# EAGLE design audio-mixer-smd (EAGLE 6.6.0)
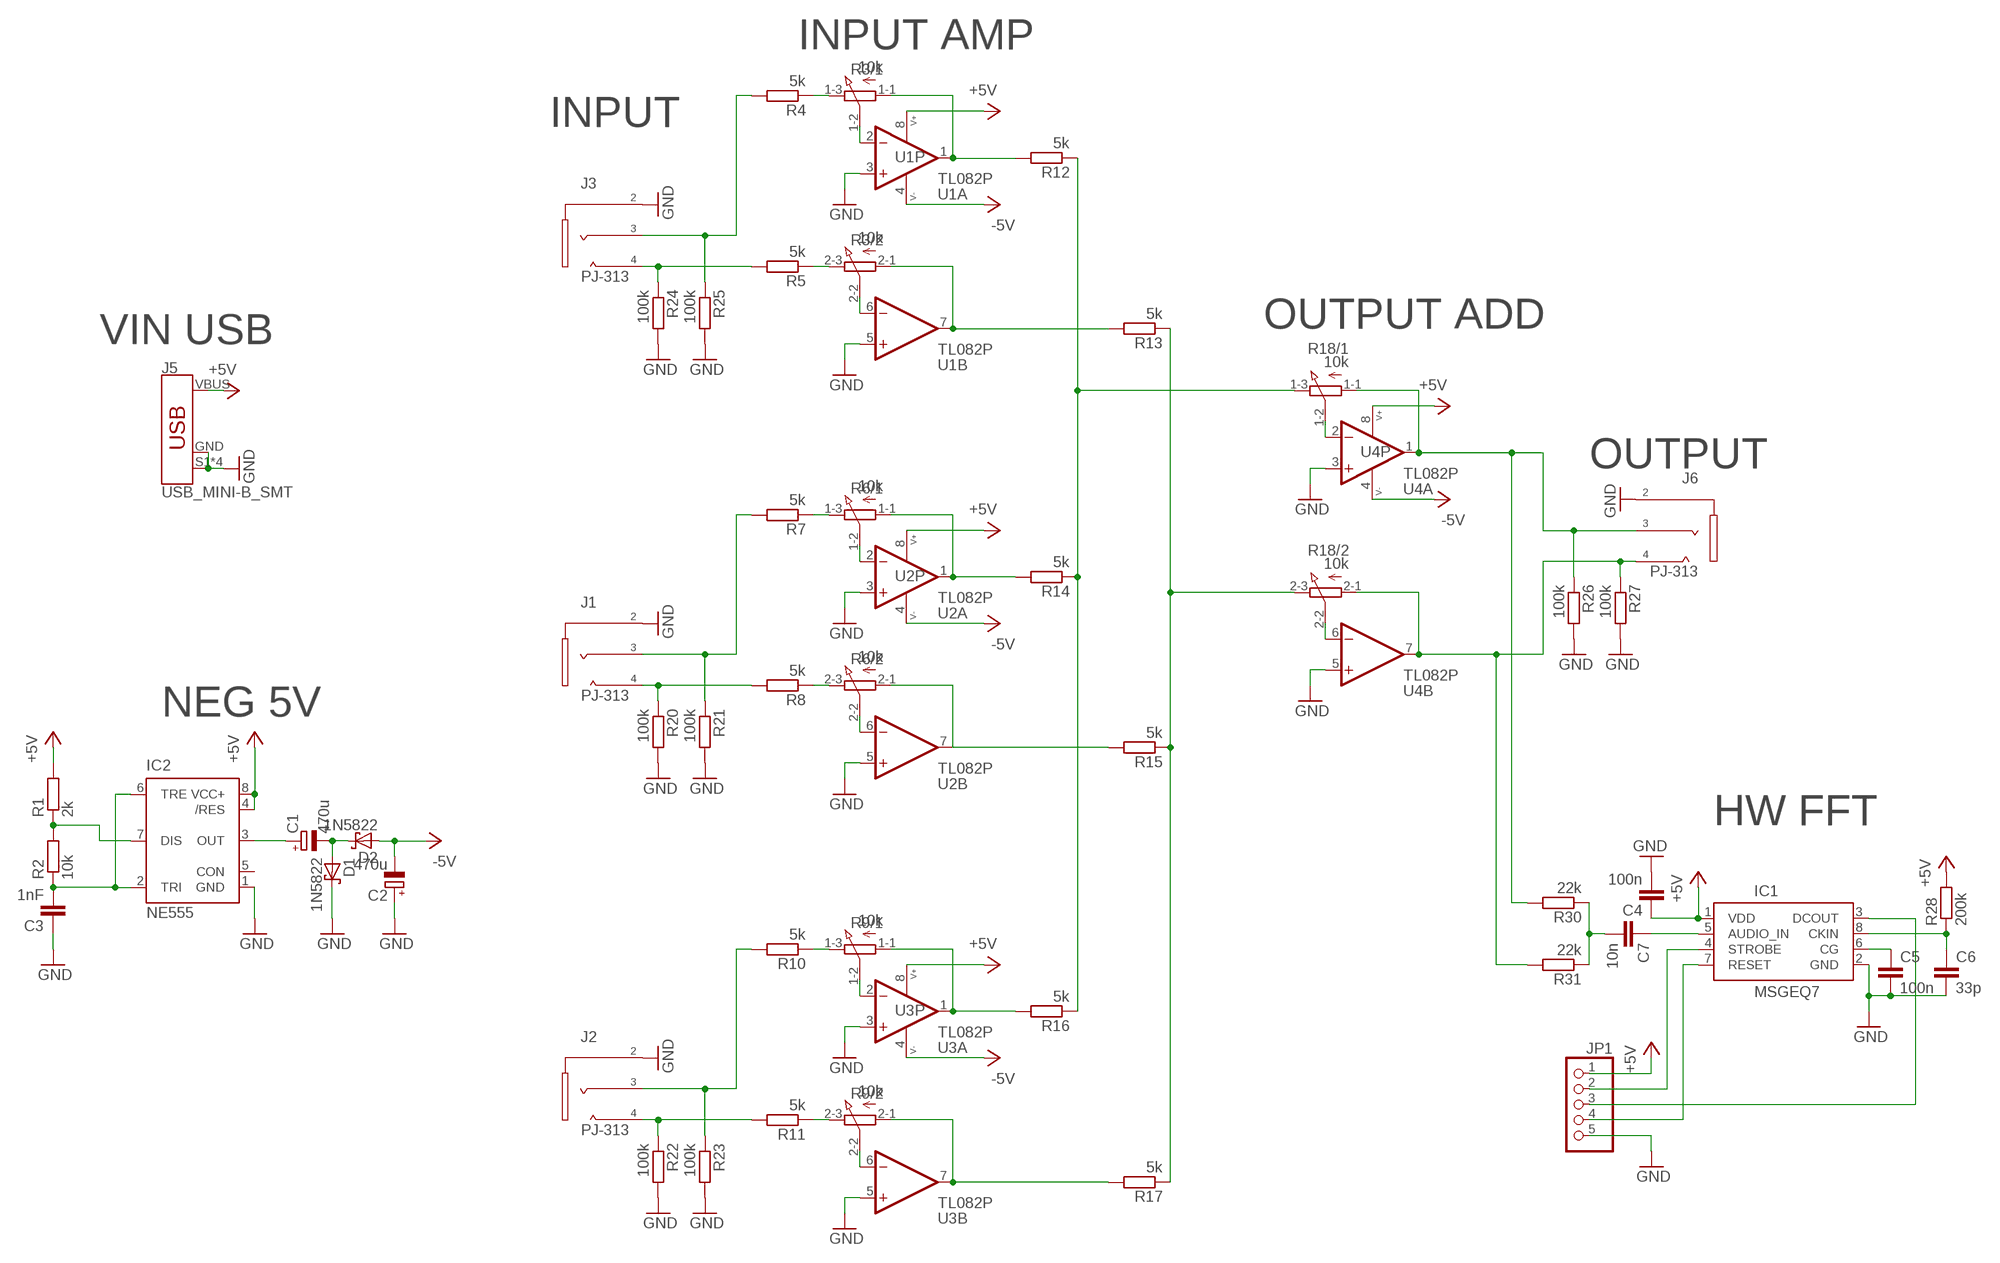
[diagram p0: schematic, sheet 1]

## Parts
C1  470u  CPOL-EUE5-8.5  [E5-8,5]
C2  470u  CPOL-EUE5-8.5  [E5-8,5]
C3  1nF  C-EUC0805  [C0805]
C4  100n  C-EUC0805  [C0805]
C5  100n  C-EUC0805  [C0805]
C6  33p  C-EUC0805  [C0805]
C7  10n  C-EUC0805  [C0805]
D1  1N5822  1N5817-B  [DO41-7.6]
D2  1N5822  1N5817-B  [DO41-7.6]
IC1  MSGEQ7DIP  [DIL08]
IC2  NE555  [DIL-08]
J1  PJ-313  [PJ-313]
J2  PJ-313  [PJ-313]
J3  PJ-313  [PJ-313]
J5  USB_MINI-B_SMT  [USB-MINIB]
J6  PJ-313  [PJ-313]
JP1  PINHD-1X05_2.54-S  [1X05-S]
R1  2k  R-EU_R0805  [R0805]
R2  10k  R-EU_R0805  [R0805]
R3  10k  3RP/1610G  [3RP/1610G]
R4  5k  R-EU_R0805  [R0805]
R5  5k  R-EU_R0805  [R0805]
R6  10k  3RP/1610G  [3RP/1610G]
R7  5k  R-EU_R0805  [R0805]
R8  5k  R-EU_R0805  [R0805]
R9  10k  3RP/1610G  [3RP/1610G]
R10  5k  R-EU_R0805  [R0805]
R11  5k  R-EU_R0805  [R0805]
R12  5k  R-EU_R0805  [R0805]
R13  5k  R-EU_R0805  [R0805]
R14  5k  R-EU_R0805  [R0805]
R15  5k  R-EU_R0805  [R0805]
R16  5k  R-EU_R0805  [R0805]
R17  5k  R-EU_R0805  [R0805]
R18  10k  3RP/1610G  [3RP/1610G]
R20  100k  R-EU_R0805  [R0805]
R21  100k  R-EU_R0805  [R0805]
R22  100k  R-EU_R0805  [R0805]
R23  100k  R-EU_R0805  [R0805]
R24  100k  R-EU_R0805  [R0805]
R25  100k  R-EU_R0805  [R0805]
R26  100k  R-EU_R0805  [R0805]
R27  100k  R-EU_R0805  [R0805]
R28  200k  R-EU_R0805  [R0805]
R30  22k  R-EU_R0805  [R0805]
R31  22k  R-EU_R0805  [R0805]
U1  TL082P  [DIL08]
U2  TL082P  [DIL08]
U3  TL082P  [DIL08]
U4  TL082P  [DIL08]

## Nets
+5V [power]: C4.1 IC1.1(VDD) IC2.4(/RES) IC2.8(VCC+) J5.VBUS JP1.1 R1.2 R28.2 U1.8(P:V+) U2.8(P:V+) U3.8(P:V+) U4.8(P:V+)
-5V [power]: C2.- D2.A U1.4(P:V-) U2.4(P:V-) U3.4(P:V-) U4.4(P:V-)
GND [power]: C2.+ C3.1 C4.2 C5.2 C6.2 D1.C IC1.2(GND) IC2.1(GND) J1.2_1 J1.2_2 J2.2_1 J2.2_2 J3.2_1 J3.2_2 J5.GND J5.S1(SHIELD) J5.S2(SHIELD) J5.S3(SHIELD) J5.S4(SHIELD) J6.2_1 J6.2_2 JP1.5 R20.2 R21.2 R22.2 R23.2 R24.2 R25.2 R26.2 R27.2 U1.3(A:+IN) U1.5(B:+IN) U2.3(A:+IN) U2.5(B:+IN) U3.3(A:+IN) U3.5(B:+IN) U4.3(A:+IN) U4.5(B:+IN)
N$1: C3.2 IC2.2(TRI) IC2.6(TRE) R2.1
N$2: IC2.7(DIS) R1.1 R2.2
N$3: R3.1-1(/1:A) R12.2 U1.1(A:OUT)
N$4 [power]: C1.- D1.A D2.C
N$5 [power]: C1.+ IC2.3(OUT)
N$6: R3.1-2(/1:S) U1.2(A:-IN)
N$7: R3.2-1(/2:A) R13.2 U1.7(B:OUT)
N$8: R3.2-2(/2:S) U1.6(B:-IN)
N$9: R3.2-3(/2:E) R5.1
N$10: R3.1-3(/1:E) R4.1
N$11: J3.4_1 J3.4_2 R5.2 R24.1
N$12: J3.3 R4.2 R25.1
N$13: R6.1-1(/1:A) R14.2 U2.1(A:OUT)
N$14: R6.1-2(/1:S) U2.2(A:-IN)
N$15: R6.2-1(/2:A) R15.2 U2.7(B:OUT)
N$16: R6.2-2(/2:S) U2.6(B:-IN)
N$17: R6.2-3(/2:E) R8.1
N$18: R6.1-3(/1:E) R7.1
N$19: J1.4_1 J1.4_2 R8.2 R20.1
N$20: J1.3 R7.2 R21.1
N$21: R9.1-1(/1:A) R16.2 U3.1(A:OUT)
N$22: R9.1-2(/1:S) U3.2(A:-IN)
N$23: R9.2-1(/2:A) R17.2 U3.7(B:OUT)
N$24: R9.2-2(/2:S) U3.6(B:-IN)
N$25: R9.2-3(/2:E) R11.1
N$26: R9.1-3(/1:E) R10.1
N$27: J2.4_1 J2.4_2 R11.2 R22.1
N$28: J2.3 R10.2 R23.1
N$29: R12.1 R14.1 R16.1 R18.1-3(/1:E)
N$30: R13.1 R15.1 R17.1 R18.2-3(/2:E)
N$31: J6.3 R18.1-1(/1:A) R26.1 R30.2 U4.1(A:OUT)
N$32: J6.4_1 J6.4_2 R18.2-1(/2:A) R27.1 R31.2 U4.7(B:OUT)
N$33: R18.2-2(/2:S) U4.6(B:-IN)
N$34: R18.1-2(/1:S) U4.2(A:-IN)
N$35: C5.1 IC1.6(CG)
N$37: C6.1 IC1.8(CKIN) R28.1
N$38: C7.1 IC1.5(AUDIO_IN)
N$39: C7.2 R30.1 R31.1
N$41: IC1.4(STROBE) JP1.2
N$42: IC1.7(RESET) JP1.4
N$43: IC1.3(DCOUT) JP1.3
Unconnected: IC2.5(CON)

## Notes on the sheet
- INPUT AMP
- INPUT
- OUTPUT ADD
- VIN USB
- OUTPUT
- NEG 5V
- HW FFT

## Library data of the parts
C1 C2 = rcl:CPOL-EU: POLARIZED CAPACITOR, European symbol
C3-C7 = rcl:C-EU: CAPACITOR, European symbol
D1 D2 = diode:1N581*: 1.0A SCHOTTKY BARRIER RECTIFIER Source: http://www.diodes.com/datasheets/ds23001.pdf
IC1 = msgeq7:MSGEQ7: 7-band graphic equalizer
IC2 = st-microelectronics:NE555: General purpose bipolar Timer; MF: Arrow Electronics; MPN: NE555N; OC_FARNELL: 1467742; OC_NEWARK: 89K1486
J1-J3 J6 = headphonejack:PJ-313: 3.5mm jack description Brover Geldrop MK
J5 = SparkFun-Connectors:USB_MINI-B: USB type Mini-B Connector Breaks out 5th pin, and includes shield pins if needed. SparkFun Products: SparkFun FTDI Basic Breakout <https://www.sparkfun.com/products/9716> SparkFun XBee Explorer USB <https://www.sparkfun.com/products/11812> SparkFun Redboard <https://www.sparkfun.com/products/12757>; PROD_ID: CONN-08193; SF_ID: PRT-00587
JP1 = pinhead-2:PINHD-1X05: PIN HEADER
R1 R2 R4 R5 R7 R8 R10-R17 R20-R28 R30 R31 = rcl:R-EU_: RESISTOR, European symbol
R3 R6 R9 R18 = pot:3RP/1610G: 16mm Potentiometer two level Source: http://www.alphapotentiometers.net/html/16mm_pot_2.html
U1-U4 = op-amp:TL082: JFET OP-AMP - Dual

## Net classes
0 default: width 0.406 mm, drill 0.5 mm
1 power: width 0.61 mm, drill 0.6 mm

## Board
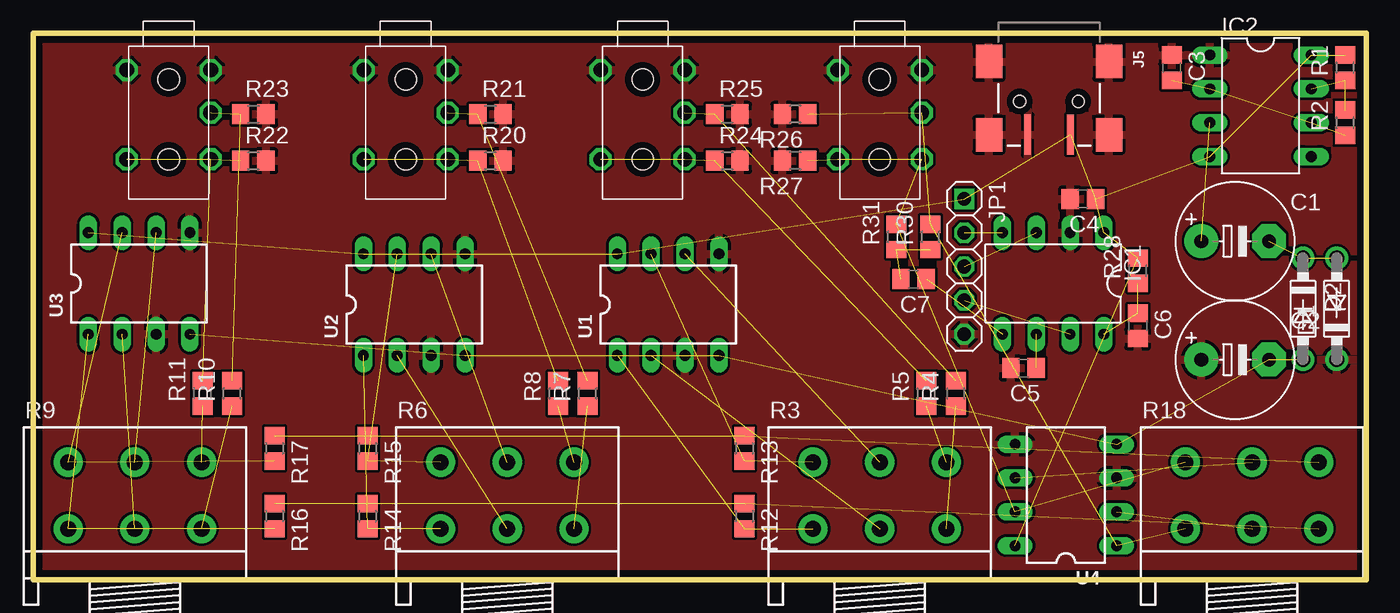
[diagram p1: board, top side]
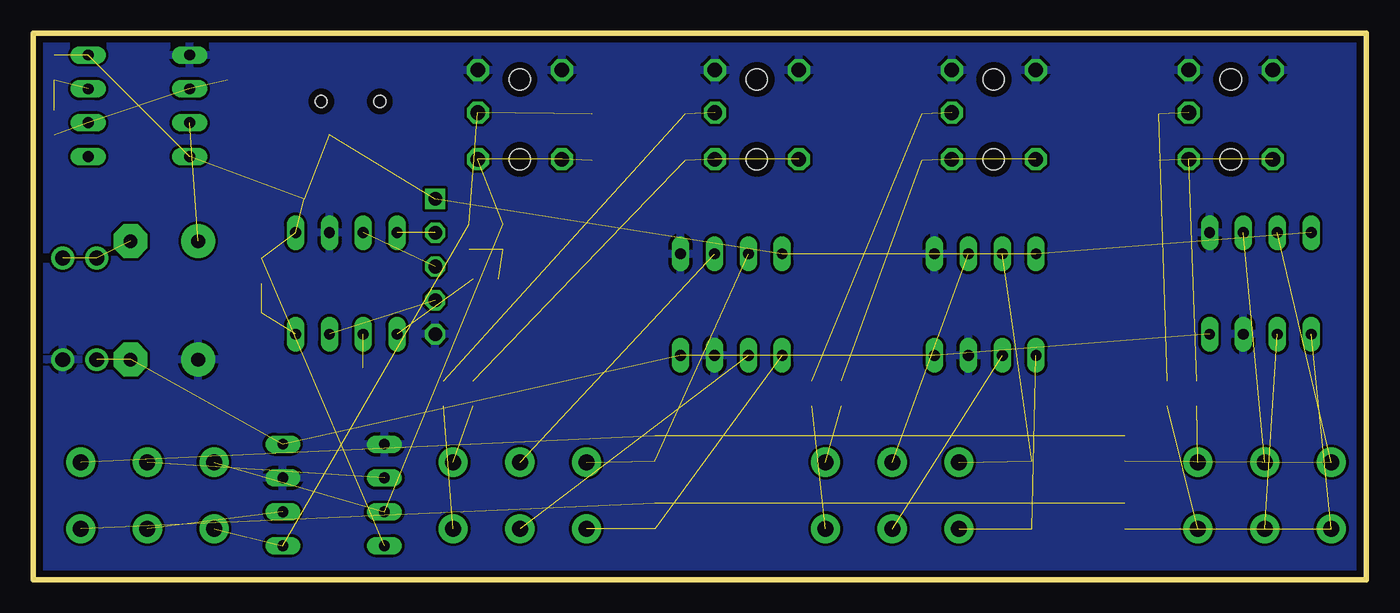
[diagram p2: board, bottom side, seen from below]

Size 100 x 41 mm. Coordinates in mm from the lower left corner, seen from the top.
Outline: 0,0 0,41 100,41 100,0 0,0
Copper layers (1*16): Top 0.035mm / dielectric 1.5mm / Bottom 0.035mm
Design rules "default *": minimum track width 10mil, minimum drill 0.5mm, track to track 8mil, track to pad 8mil, pad to pad 8mil, via to via 8mil, smd to smd 0mil, copper to edge 20mil, drill to drill 8mil, minimum pad ring 10mil, minimum via ring 8mil, stop-mask expansion 4mil, vias tented up to drill 0.6mm, thermal gap 10mil

### Footprints (pad centres in the part's own frame; a part is rotated, then mirrored left to right if it is on the bottom)
E5-8,5 = drill 1.016 pad 2.54: + -2.54,0 | drill 1.016 pad 2.54 octagon: - 2.54,0
C0805 = smd 1.3 x 1.5: 1 -0.95,0; 2 0.95,0
DO41-7.6 = drill 1.1 pad 1.7: A 3.81,0; C -3.81,0
DIL08 = drill 0.813 long: 1 -3.81,-3.81; 2 -1.27,-3.81; 3 1.27,-3.81; 4 3.81,-3.81; 5 3.81,3.81; 6 1.27,3.81; 7 -1.27,3.81; 8 -3.81,3.81
DIL-08 = drill 0.813 long: 1 -3.81,-3.81; 2 -1.27,-3.81; 3 1.27,-3.81; 4 3.81,-3.81; 5 3.81,3.81; 6 1.27,3.81; 7 -1.27,3.81; 8 -3.81,3.81
PJ-313 = drill 1.1 octagon: 2_1 -3.95,3.15; 2_2 -3.95,-3.15; 3 -0.75,3.15; 4_1 2.75,3.15; 4_2 2.75,-3.15 | hole 1.6: -3.25,0; 2.75,0
USB-MINIB = smd 3 x 0.5: GND 2.5,-1.6; VBUS 2.5,1.6 | smd 2.5 x 2: S1 -3,4.5; S2 2.5,4.5; S3 -3,-4.5; S4 2.5,-4.5 | hole 0.9: 0,2.2; 0,-2.2
1X05-S = drill 1.016 square: 1 -5.08,0 | drill 1.016 octagon: 2 -2.54,0; 3 0,0; 4 2.54,0; 5 5.08,0
R0805 = smd 1.3 x 1.5: 1 -0.95,0; 2 0.95,0
3RP/1610G = drill 1.2 pad 2.184: 1-1 -5,0; 1-2 0,0; 1-3 5,0; 2-1 -5,5; 2-2 0,5; 2-3 5,5

### Placement (x,y rotation side)
C1  90.17,25.4 0 top
C2  90.17,16.51 0 top
C3  85.41,38.42 270 top
C4  78.74,28.57 180 top
C5  74.3,15.88 180 top
C6  82.87,19.05 270 top
C7  66.04,22.54 180 top
D1  97.79,20.32 90 top
D2  95.25,20.32 270 top
IC1  76.52,22.23 180 top
IC2  92.08,35.56 270 top
J1  27.94,34.29 270 top
J2  10.16,34.29 270 top
J3  45.72,34.29 270 top
J5  76.2,35.88 270 top
J6  63.5,34.29 270 top
JP1  69.85,23.5 270 top
R1  98.42,38.42 90 top
R2  98.42,34.29 90 top
R3  63.5,3.81 0 top
R4  69.22,13.97 90 top
R5  66.99,13.97 90 top
R6  35.56,3.81 0 top
R7  41.59,13.97 90 top
R8  39.37,13.97 90 top
R9  7.62,3.81 0 top
R10  14.92,13.97 90 top
R11  12.7,13.97 90 top
R12  53.34,4.76 270 top
R13  53.34,9.84 270 top
R14  25.08,4.76 270 top
R15  25.08,9.84 270 top
R16  18.1,4.76 270 top
R17  18.1,9.84 270 top
R18  91.44,3.81 0 top
R20  34.29,31.43 0 top
R21  34.29,34.92 0 top
R22  16.51,31.43 0 top
R23  16.51,34.92 0 top
R24  52.07,31.43 0 top
R25  52.07,34.92 0 top
R26  57.15,34.92 180 top
R27  57.15,31.43 180 top
R28  82.87,23.18 90 top
R30  67.31,25.72 90 top
R31  64.77,25.72 90 top
U1  47.62,20.64 0 top
U2  28.57,20.64 0 top
U3  7.94,22.23 0 top
U4  77.47,6.35 90 top

### Tracks (layer width: path | path; a pad name or v marks a point on that pad's centre or on a via)
+5V  (11 unrouted)
-5V  (5 unrouted)
GND
  pour Bottom: -3.49,44.13 103.82,44.13 103.82,-1.91 -3.49,-1.91
  pour Top: 0.32,40.64 100.01,40.96 99.69,0.32 0,0
N$1  (3 unrouted)
N$2  (2 unrouted)
N$3  (2 unrouted)
N$4  (2 unrouted)
N$5  (1 unrouted)
N$6  (1 unrouted)
N$7  (2 unrouted)
N$8  (1 unrouted)
N$9  (1 unrouted)
N$10  (1 unrouted)
N$11  (3 unrouted)
N$12  (2 unrouted)
N$13  (2 unrouted)
N$14  (1 unrouted)
N$15  (2 unrouted)
N$16  (1 unrouted)
N$17  (1 unrouted)
N$18  (1 unrouted)
N$19  (3 unrouted)
N$20  (2 unrouted)
N$21  (2 unrouted)
N$22  (1 unrouted)
N$23  (2 unrouted)
N$24  (1 unrouted)
N$25  (1 unrouted)
N$26  (1 unrouted)
N$27  (3 unrouted)
N$28  (2 unrouted)
N$29  (3 unrouted)
N$30  (3 unrouted)
N$31  (4 unrouted)
N$32  (5 unrouted)
N$33  (1 unrouted)
N$34  (1 unrouted)
N$35  (1 unrouted)
N$37  (2 unrouted)
N$38  (1 unrouted)
N$39  (2 unrouted)
N$41  (1 unrouted)
N$42  (1 unrouted)
N$43  (1 unrouted)